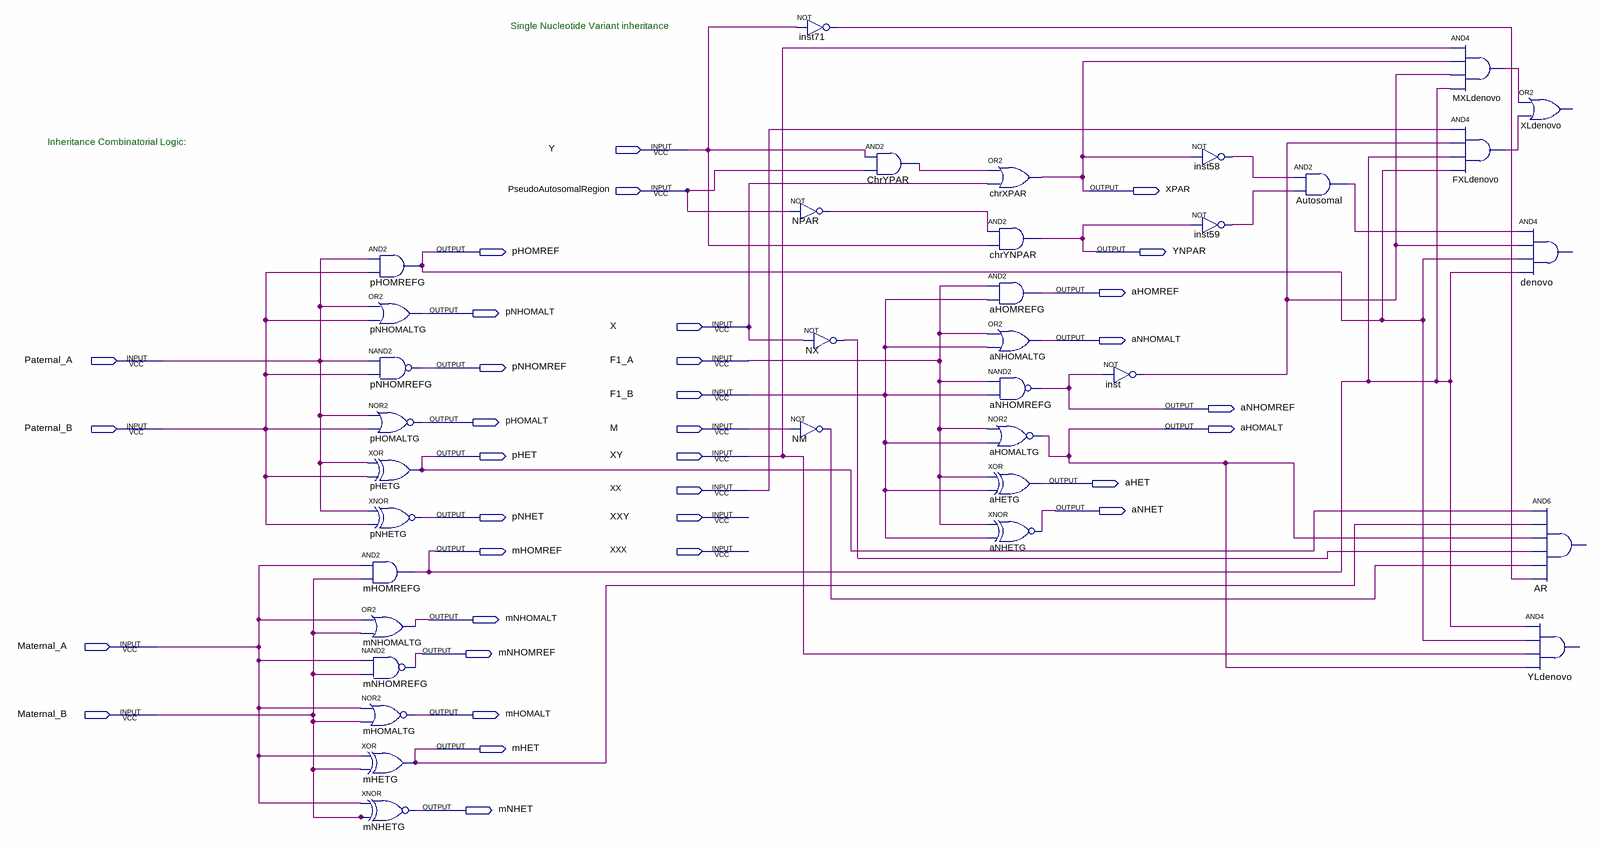
[diagram p0: schematic sheet]
// Quartus schematic CycloneII_20120122.bdf as structural Verilog: 35 symbols, 34 pins
module CycloneII_20120122 (
  input  Y,
  input  PseudoAutosomalRegion,
  input  X,
  input  Paternal_A,
  input  F1_A,
  input  F1_B,
  input  Paternal_B,
  input  M,
  input  XY,
  input  XX,
  input  XXY,
  input  XXX,
  input  Maternal_A,
  input  Maternal_B,
  output XPAR,
  output pHOMREF,
  output YNPAR,
  output aHOMREF,
  output pNHOMALT,
  output aNHOMALT,
  output pNHOMREF,
  output aNHOMREF,
  output pHOMALT,
  output aHOMALT,
  output pHET,
  output aHET,
  output aNHET,
  output pNHET,
  output mHOMREF,
  output mNHOMALT,
  output mNHOMREF,
  output mHOMALT,
  output mHET,
  output mNHET
);

  wire Autosomal_out, ChrYPAR_out, FXLdenovo_out, inst58_out, inst59_out, inst71_out, inst_out,
       MXLdenovo_out, NM_out, NPAR_out, NX_out;

  and pHOMREFG (pHOMREF, Paternal_A, Paternal_B);
  or pNHOMALTG (pNHOMALT, Paternal_A, Paternal_B);
  nand pNHOMREFG (pNHOMREF, Paternal_A, Paternal_B);
  nor pHOMALTG (pHOMALT, Paternal_A, Paternal_B);
  xor pHETG (pHET, Paternal_A, Paternal_B);
  xnor pNHETG (pNHET, Paternal_A, Paternal_B);
  and mHOMREFG (mHOMREF, Maternal_A, Maternal_B);
  or mNHOMALTG (mNHOMALT, Maternal_A, Maternal_B);
  nand mNHOMREFG (mNHOMREF, Maternal_A, Maternal_B);
  nor mHOMALTG (mHOMALT, Maternal_A, Maternal_B);
  xor mHETG (mHET, Maternal_A, Maternal_B);
  xnor mNHETG (mNHET, Maternal_A, Maternal_B);
  not inst71 (inst71_out, Y);
  not NPAR (NPAR_out, PseudoAutosomalRegion);
  not NX (NX_out, X);
  not NM (NM_out, M);
  and ChrYPAR (ChrYPAR_out, Y, PseudoAutosomalRegion);
  or chrXPAR (XPAR, ChrYPAR_out, X);
  and chrYNPAR (YNPAR, NPAR_out, Y);
  and aHOMREFG (aHOMREF, F1_A, F1_B);
  or aNHOMALTG (aNHOMALT, F1_A, F1_B);
  nand aNHOMREFG (aNHOMREF, F1_A, F1_B);
  nor aHOMALTG (aHOMALT, F1_A, F1_B);
  xor aHETG (aHET, F1_A, F1_B);
  xnor aNHETG (aNHET, F1_A, F1_B);
  not inst (inst_out, aNHOMREF);
  not inst58 (inst58_out, XPAR);
  not inst59 (inst59_out, YNPAR);
  and Autosomal (Autosomal_out, inst58_out, inst59_out);
  and MXLdenovo (MXLdenovo_out, XY, XPAR, inst_out, mHOMREF);
  and FXLdenovo (FXLdenovo_out, XX, inst_out, mHOMREF, pHOMREF);
  // OR2 XLdenovo has open pins: IN1=MXLdenovo_out, IN2=FXLdenovo_out, OUT=open
  // AND4 denovo has open pins: IN1=Autosomal_out, IN2=inst_out, IN3=pHOMREF, IN4=mHOMREF, OUT=open
  // AND6 AR has open pins: IN1=pHET, IN2=mHET, IN3=aHOMALT, IN4=NX_out, IN5=NM_out, IN6=inst71_out, OUT=open
  // AND4 YLdenovo has open pins: IN1=mHOMREF, IN2=pHOMREF, IN3=XY, IN4=aHOMALT, OUT=open

  // Notes on the sheet:
  //   Single Nucleotide Variant inheritance
  //   Inheritance Combinatorial Logic:
endmodule
